# Altium schematic sheet Sheet2.SchDoc
size A4; SheetNumber: 1; SheetTotal: 1
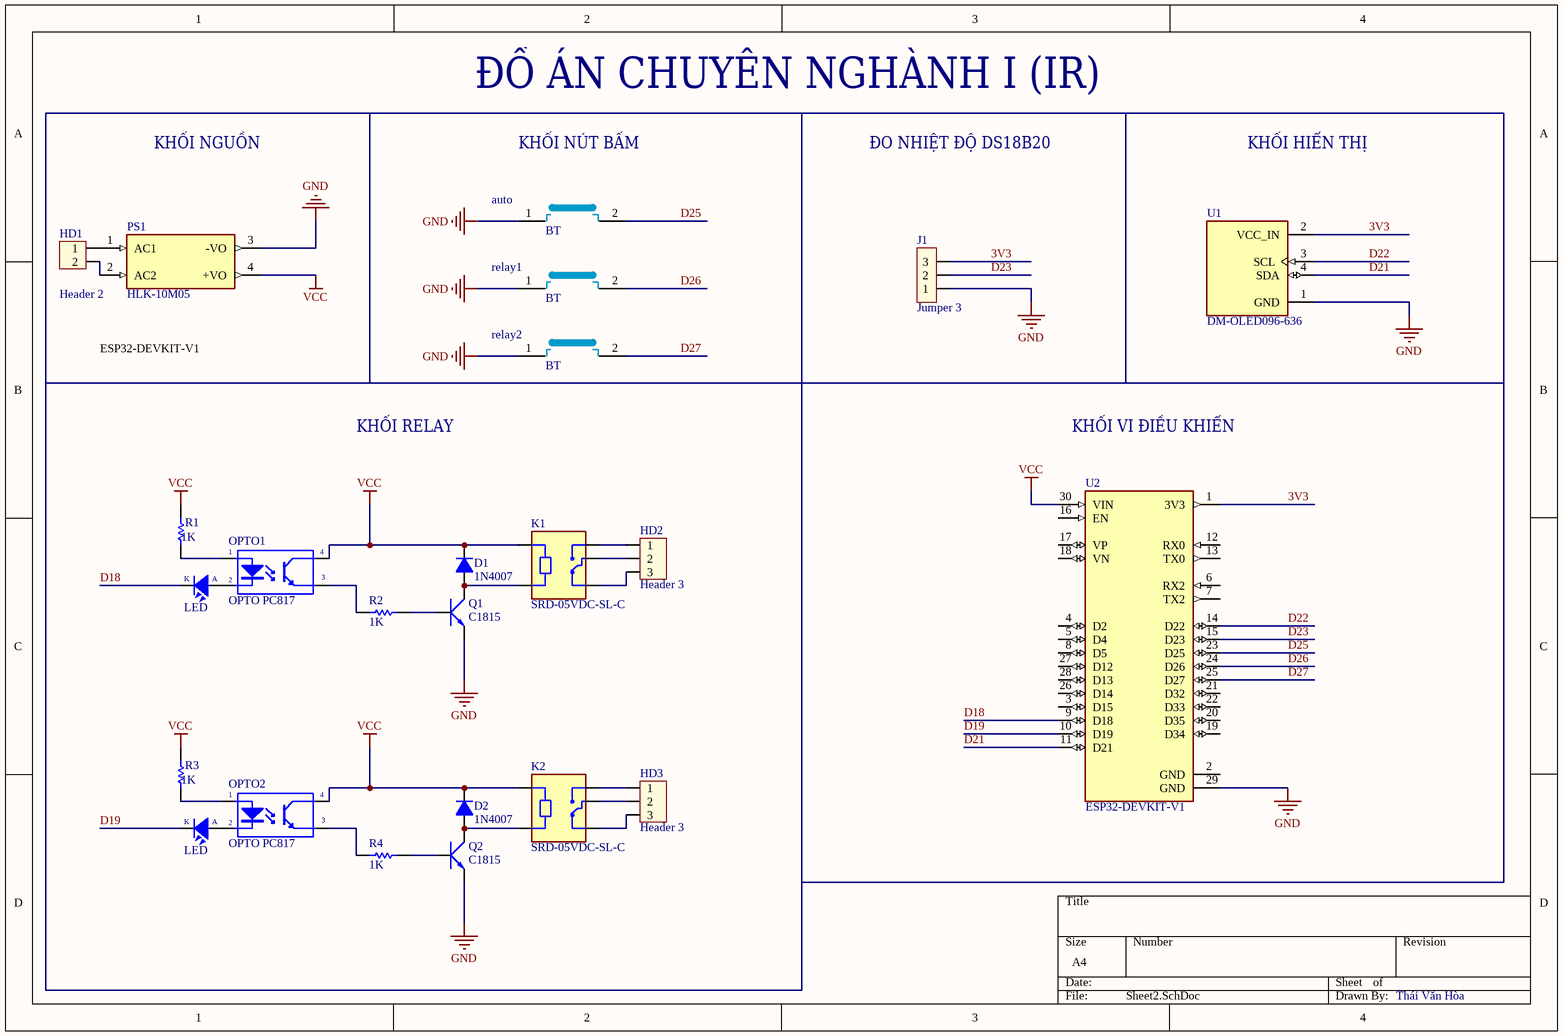
[diagram p0: Sheet2.SchDoc]

## Parts
BT1  BT  [SW4]
BT2  BT  [SW4]
BT3  BT  [SW4]
D1  1N4007  [D1A]
D2  1N4007  [D1A]
HD1  Header 2  [HED2]
HD2  Header 3  [HED3]
HD3  Header 3  [HED3]
J1  Jumper 3  [JP3]
K1  SRD-05VDC-SL-C  [RELAY_SRD-05VDC-SL-C]
K2  SRD-05VDC-SL-C  [RELAY_SRD-05VDC-SL-C]
LED1  LED  [LED-3]
LED2  LED  [LED-3]
OPTO1  OPTO PC817  [DIP4/W0.3]
OPTO2  OPTO PC817  [DIP4/W0.3]
PS1  HLK-10M05  [CONV_HLK-10M05]
Q1  C1815  [QTO-92]
Q2  C1815  [QTO-92]
R1  value 1K  [R1/4W]  (hidden comment: Res1)
R2  value 1K  [R1/4W]  (hidden comment: Res1)
R3  value 1K  [R1/4W]  (hidden comment: Res1)
R4  value 1K  [R1/4W]  (hidden comment: Res1)
U1  DM-OLED096-636  [MODULE_DM-OLED096-636]
U2  ESP32-DEVKIT-V1  [MODULE_ESP32_DEVKIT_V1]

## Nets
GND: BT1.1 BT2.1 BT3.1 J1.1 PS1.3(-VO) Q1.1(E) Q2.1(E) U1.1(GND) U2.29(GND)
VCC: D1.2(K) D2.2(K) K1.A1 K2.A1 OPTO1.4(C) OPTO2.4(C) PS1.4(+VO) R1.2 R3.2 U2.30(VIN)
3V3: J1.3 U1.2(VCC_IN) U2.1(3V3)
D18: LED1.2(K) U2.9(D18)
D19: LED2.2(K) U2.10(D19)
D21: U1.4(SDA) U2.11(D21)
D22: U1.3(SCL) U2.14(D22)
D23: J1.2 U2.15(D23)
D25: BT1.2 U2.23(D25)
D26: BT2.2 U2.24(D26)
D27: BT3.2 U2.25(D27)
NetD1_1: D1.1(A) K1.A2 Q1.2(C)
NetD2_1: D2.1(A) K2.A2 Q2.2(C)
NetHD1_1: HD1.1 PS1.1(AC1)
NetHD1_2: HD1.2 PS1.2(AC2)
NetHD2_1: HD2.1 K1.NO
NetHD2_2: HD2.2 K1.COM
NetHD2_3: HD2.3 K1.NC
NetHD3_1: HD3.1 K2.NO
NetHD3_2: HD3.2 K2.COM
NetHD3_3: HD3.3 K2.NC
NetLED1_1: LED1.1(A) OPTO1.2(K)
NetLED2_1: LED2.1(A) OPTO2.2(K)
NetOPTO1_1: OPTO1.1(A) R1.1
NetOPTO1_3: OPTO1.3(E) R2.2
NetOPTO2_1: OPTO2.1(A) R3.1
NetOPTO2_3: OPTO2.3(E) R4.2
NetQ1_3: Q1.3(B) R2.1
NetQ2_3: Q2.3(B) R4.1

Not connected (* = marked no-connect by the designer): U2 2(GND) 3(D15) 4(D2) 5(D4) 6(RX2) 7(TX2) 8(D5) 12(RX0) 13(TX0) 16(EN) 17(VP) 18(VN) 19(D34) 20(D35) 21(D32) 22(D33) 26(D14) 27(D12) 28(D13)

## Notes on the sheet
- ĐỒ ÁN CHUYÊN NGHÀNH I (IR)
- KHỐI NGUỒN
- KHỐI NÚT BẤM
- ĐO NHIỆT ĐỘ DS18B20
- KHỐI HIỂN THỊ
- (near BT1) auto
- (near BT2) relay1
- ESP32-DEVKIT-V1
- (near BT3) relay2
- KHỐI RELAY
- KHỐI VI ĐIỀU KHIỂN
- Thái Văn Hòa

## Library data of the parts
BT1-BT3 = BUTTON
D1 D2 = D1A: Diode 1A; Value: 1N4007
HD1 = Hed2: Header 2 (Green); Value: Header 2
HD2 HD3 = Header 3: Header 3 (Green); Value: Header 3
J1 = JP3: Value: J3
K1 K2 = SRD-05VDC-SL-C: 5V Trigger Relay Module For Arduino And Raspberry Pi 5V Trigger Relay Module For Arduino And Raspberry Pi; MF: Songle Relay; Check_prices: https://www.snapeda.com/parts/SRD-05VDC-SL-C/Songle+Relay/view-part/?ref=eda; Value: *; Availability: Not in stock; Price: None; Package: NON STANDARD-5 Songle Relay; MP: SRD-05VDC-SL-C; SnapEDA_Link: https://www.snapeda.com/parts/SRD-05VDC-SL-C/Songle+Relay/view-part/?ref=snap
LED1 LED2 = LED: LED Single colour Green and Red; Value: LED 3 ly Single Colour
OPTO1 OPTO2 = OPTO PC817: Single Opto; Value: PC817
PS1 = HLK-10M05: 10W Ultra-Compact Power Module; MF: Hi-link; SnapEDA_Link: https://www.snapeda.com/parts/HLK-10M05/Hi-link/view-part/?ref=snap; Package: Package; Value: *; MP: HLK-10M05; Check_prices: https://www.snapeda.com/parts/HLK-10M05/Hi-link/view-part/?ref=eda
Q1 Q2 = C1815: NPN 600mW, ECB; Value: C1815
R1-R4 = Res1_4: Resistor; Manufacturer: Generic Components; Class: Passive; Published: 08/06/2000; Publisher: Altium Hobart Technology Centre; SubClass: Resistor
U1 = DM-OLED096-636: 0.96â€ 128 X 64 MONOCHROME GRAPHIC OLED DISPLAY MODULE - I2C; SnapEDA_Link: https://www.snapeda.com/parts/DM-OLED096-636/Display+Module/view-part/?ref=snap; Package: Package; Value: *; MF: Display Module; MP: DM-OLED096-636; Check_prices: https://www.snapeda.com/parts/DM-OLED096-636/Display+Module/view-part/?ref=eda
U2 = ESP32-DEVKIT-V1: Dual core, Wi-Fi: 2.4 GHz up to 150 Mbits/s,BLE (Bluetooth Low Energy) and legacy Bluetooth, 32 bits, Up to 240 MHz; MF: Do it; Price: None; Availability: Not in stock; Package: None; MP: ESP32-DEVKIT-V1; Value: *; SnapEDA_Link: https://www.snapeda.com/parts/ESP32-DEVKIT-V1/Do+it/view-part/?ref=snap; Check_prices: https://www.snapeda.com/parts/ESP32-DEVKIT-V1/Do+it/view-part/?ref=eda